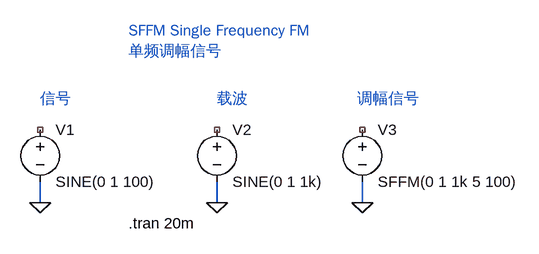
[diagram p0: schematic Draft4.asc]
Draft4.asc, the LTspice schematic file:
Version 4.1
SHEET 1 880 680
WIRE -64 240 -64 208
WIRE 208 240 208 208
WIRE 432 240 432 208
FLAG -64 240 0
FLAG 208 240 0
FLAG 432 240 0
SYMBOL voltage -64 112 R0
WINDOW 123 0 0 Left 0
WINDOW 39 0 0 Left 0
SYMATTR InstName V1
SYMATTR Value SINE(0 1 100)
SYMBOL voltage 208 112 R0
WINDOW 123 0 0 Left 0
WINDOW 39 0 0 Left 0
SYMATTR InstName V2
SYMATTR Value SINE(0 1 1k)
SYMBOL voltage 432 112 R0
WINDOW 123 0 0 Left 0
WINDOW 39 0 0 Left 0
SYMATTR InstName V3
SYMATTR Value SFFM(0 1 1k 5 100)
TEXT -64 80 Left 2 ;信号
TEXT 208 80 Left 2 ;载波
TEXT 424 80 Left 2 ;调幅信号
TEXT 72 -24 Left 2 ;SFFM Single Frequency FM\n单频调幅信号
TEXT 72 272 Left 2 !.tran 20m

The netlist it stands for:
* Draft4.asc
V1 NC_01 0 SINE(0 1 100)
V2 NC_02 0 SINE(0 1 1k)
V3 NC_03 0 SFFM(0 1 1k 5 100)
* 信号
* 载波
* 调幅信号
* SFFM Single Frequency FM
* 单频调幅信号
.tran 20m
.backanno
.end